# EAGLE design jill (EAGLE 7.3.0)
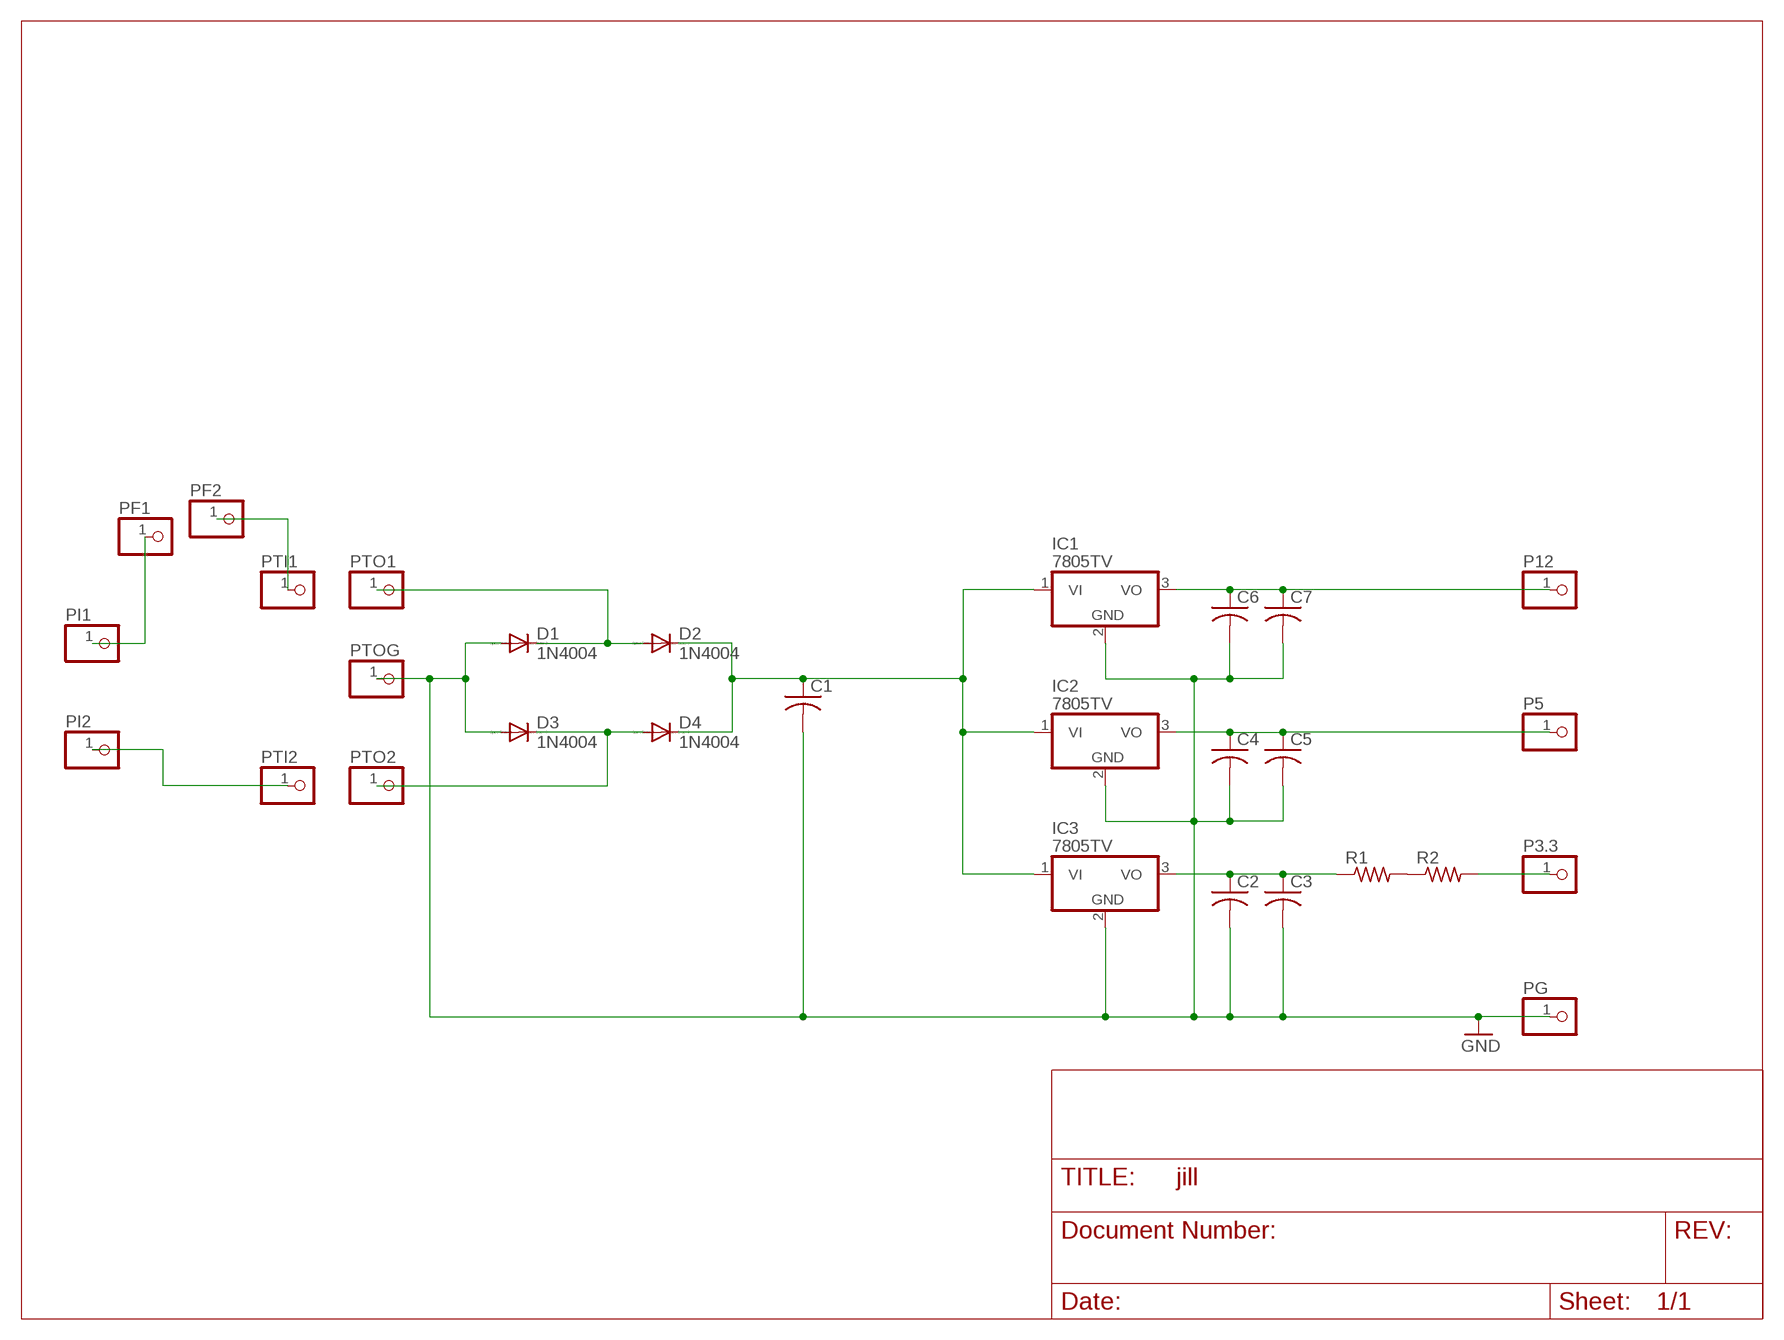
[diagram p0: schematic, sheet 1]

## Parts
C1  C-US050-075X075  [C050-075X075]
C2  C-US025-025X050  [C025-025X050]
C3  C-US025-025X050  [C025-025X050]
C4  C-US025-025X050  [C025-025X050]
C5  C-US025-025X050  [C025-025X050]
C6  C-US025-025X050  [C025-025X050]
C7  C-US025-025X050  [C025-025X050]
D1  1N4004  [DO41-10]
D2  1N4004  [DO41-10]
D3  1N4004  [DO41-10]
D4  1N4004  [DO41-10]
IC1  7805TV  [TO220V]
IC2  7805TV  [TO220V]
IC3  7805TV  [TO220V]
P3.3  PINHD-1X1  [1X01]
P5  PINHD-1X1  [1X01]
P12  PINHD-1X1  [1X01]
PF1  PINHD-1X1  [1X01]
PF2  PINHD-1X1  [1X01]
PG  PINHD-1X1  [1X01]
PI1  PINHD-1X1  [1X01]
PI2  PINHD-1X1  [1X01]
PTI1  PINHD-1X1  [1X01]
PTI2  PINHD-1X1  [1X01]
PTO1  PINHD-1X1  [1X01]
PTO2  PINHD-1X1  [1X01]
PTOG  PINHD-1X1  [1X01]
R1  R-US_0207/12  [0207/12]
R2  R-US_0207/12  [0207/12]

## Nets
GND: C1.2 C2.2 C3.2 C4.2 C5.2 C6.2 C7.2 D1.A D3.A IC1.2(GND) IC2.2(GND) IC3.2(GND) PG.1 PTOG.1
N$1: R1.2 R2.1
N$2: P3.3.1 R2.2
N$3: C2.1 C3.1 IC3.3(VO) R1.1
N$4: C4.1 C5.1 IC2.3(VO) P5.1
N$5: C6.1 C7.1 IC1.3(VO) P12.1
N$6: C1.1 D2.C D4.C IC1.1(VI) IC2.1(VI) IC3.1(VI)
N$7: D1.C D2.A PTO1.1
N$8: PF1.1 PI1.1
N$9: PF2.1 PTI1.1
N$10: PI2.1 PTI2.1
N$11: D3.C D4.A PTO2.1

## Library data of the parts
C1-C7 = rcl:C-US: CAPACITOR, American symbol
D1-D4 = diode:1N4004: DIODE general purpose rectifier, 1 A
IC1-IC3 = linear:78*: Positive VOLTAGE REGULATOR Source: http://cache.national.com/ds/LM/LM78L05.pdf http://www.fairchildsemi.com/ds/LM/LM7805.pdf
P3.3 P5 P12 PF1 PF2 PG PI1 PI2 PTI1 PTI2 PTO1 PTO2 PTOG = pinhead:PINHD-1X1: PIN HEADER
R1 R2 = rcl:R-US_: RESISTOR, American symbol

## Board
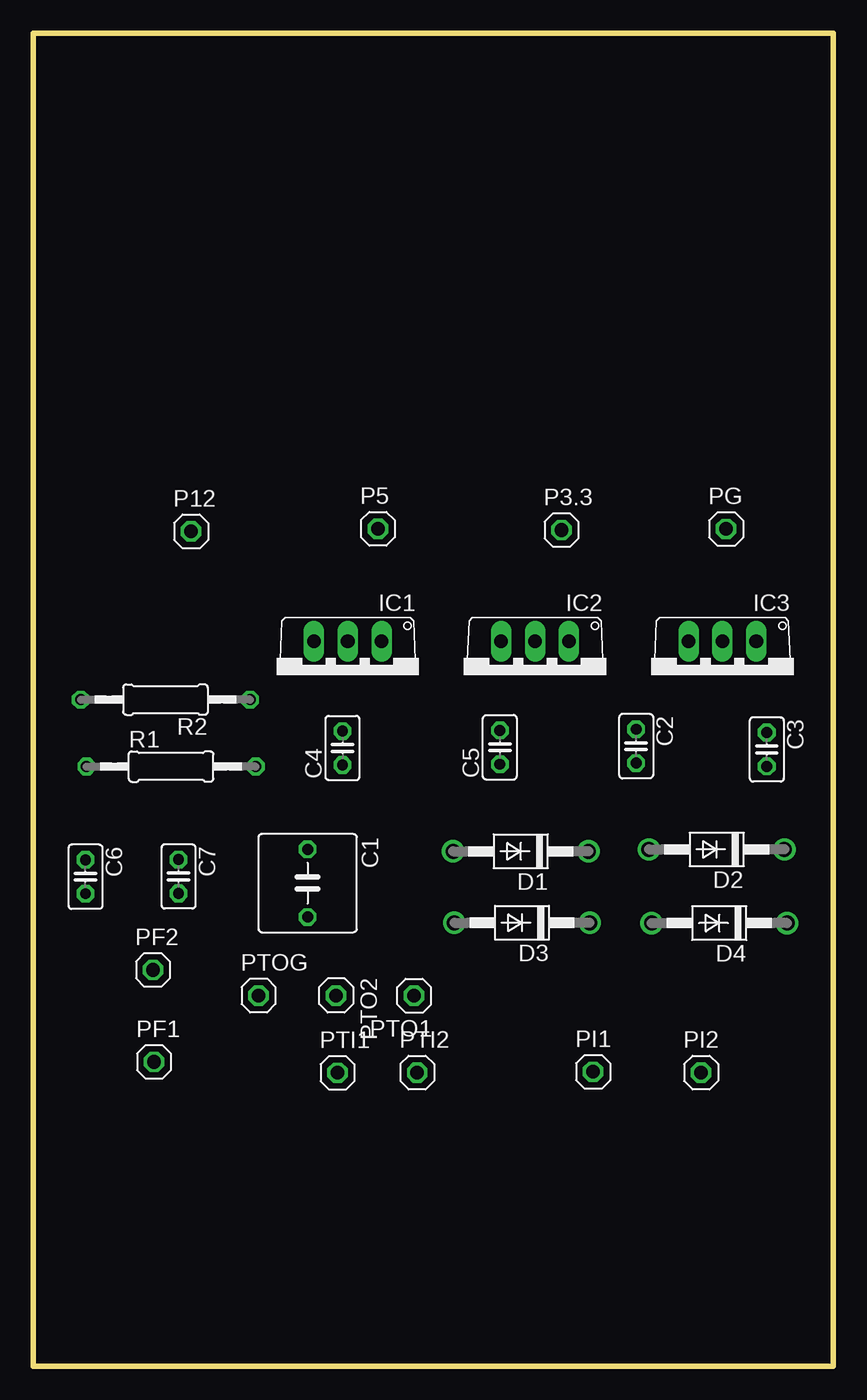
[diagram p1: board, top side]
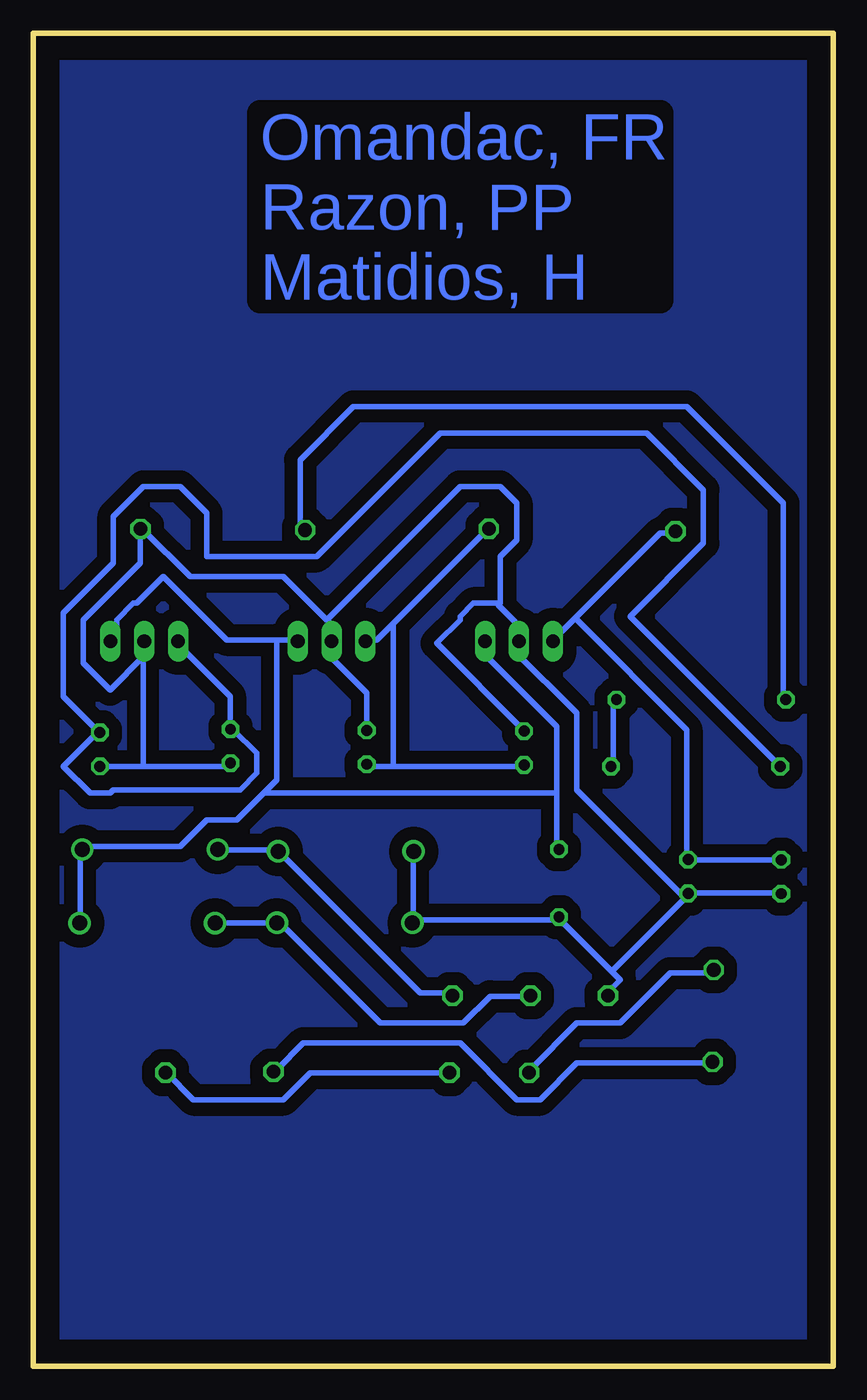
[diagram p2: board, bottom side, seen from below]

Size 60 x 100 mm. Coordinates in mm from the lower left corner, seen from the top.
Outline: 0,80 0,0
Outline: 0,0 60,0 60,100 0,100 0,0
Copper layers (1*16): Top 0.035mm / dielectric 8mm / Bottom 0.035mm
Design rules "default *": minimum track width 16mil, minimum drill 24mil, track to track 1mm, track to pad 1mm, pad to pad 16mil, via to via 16mil, smd to smd 16mil, copper to edge 70mil, drill to drill 12mil, minimum pad ring 10mil, minimum via ring 8mil, stop-mask expansion 4mil, vias tented up to drill 0mil, thermal gap 10mil

### Footprints (pad centres in the part's own frame; a part is rotated, then mirrored left to right if it is on the bottom)
C050-075X075 = drill 0.813 octagon: 1 -2.54,0; 2 2.54,0
C025-025X050 = drill 0.813 octagon: 1 -1.27,0; 2 1.27,0
DO41-10 = drill 1.118: A 5.08,0; C -5.08,0
TO220V = drill 1.016 long: 1 -2.54,-2.54; 2 0,-2.54; 3 2.54,-2.54
1X01 = drill 1.016 octagon: 1 0,0
0207/12 = drill 0.813 octagon: 1 -6.35,0; 2 6.35,0

### Placement (x,y rotation side)
C1  20.57,36.24 270 top
C2  45.21,46.52 270 top
C3  55.01,46.27 270 top
C4  23.19,46.38 90 top
C5  34.99,46.43 90 top
C6  3.91,36.72 270 top
C7  10.89,36.74 270 top
D1  36.56,38.63 180 top
D2  51.25,38.77 180 top
D3  36.65,33.27 180 top
D4  51.45,33.25 180 top
IC1  23.58,51.85 180 top
IC2  37.63,51.85 180 top
IC3  51.68,51.85 180 top
P3.3  39.61,62.73 0 top
P5  25.84,62.83 0 top
P12  11.83,62.63 0 top
PF1  9.05,22.83 0 top
PF2  8.97,29.73 0 top
PG  51.96,62.81 0 top
PI1  41.98,22.09 0 top
PI2  50.09,22.03 0 top
PTI1  22.81,22.01 0 top
PTI2  28.79,22.03 0 top
PTO1  28.56,27.79 180 top
PTO2  22.71,27.81 270 top
PTOG  16.89,27.81 0 top
R1  10.33,44.99 0 top
R2  9.91,50.01 180 top

### Tracks (layer width: path | path; a pad name or v marks a point on that pad's centre or on a via)
GND
  Bottom 0.406: 31.5,33.5 31.5,38.5 D1.A | C6.2 4,35.5 10.75,35.5 C7.2 | 16.62,29.62 16,29 17,28 PTOG.1 | 16.62,29.62 20.5,33.5 C1.2 20.75,33.5 31.5,33.5 | 16.62,29.62 11,35.25 C7.2 | 31.5,33.5 D3.A | 25.12,57.12 23.25,55.25 23.25,54.75 23.5,54.5 IC1.2 23.5,54.25 24,53.75 19.25,49 19.25,43.25 11.25,35.25 C7.2 | 25.12,57.12 25.25,57.25 27,57.25 28,56.25 28,56 29.75,54.25 23.25,47.75 C4.2 | C5.2 35,47.75 35,50.5 38,53.5 38,54 37.75,54.25 IC2.2 | 51.75,45 45.5,45 45.25,45.25 C2.2 | 51.75,45 C3.2 | 51.75,45 51.75,53.25 | 51.75,53.25 51.75,54.25 IC3.2 51.75,53.25 | 51.75,53.25 54.25,50.75 56.25,52.75 56.25,56 52,60.25 52,62.75 PG.1 51.75,62.75 48.25,59.25 41.25,59.25 38,56 | 37.75,55.75 37.75,54.5 IC2.2 | 38,56 37.75,55.75 | 25.12,57.12 25,57.25 25,60.75 23.75,62 23.75,64.75 25,66 28,66 38,56 | 37.75,55.75 IC2.2
GROUND
  pour Bottom: 0,0 60,0 60,100 0,100
N$1
  Bottom 0.406: R1.2 16.5,45 16.5,50 R2.1
N$2
  Bottom 0.406: R2.2 3.75,50.25 3.75,64.75 11,72 36,72 40,68 40,63.12 P3.3.1 39.5,62.5
N$3
  Bottom 0.406: IC3.3 49.25,54.25 45.25,50.25 45.25,48 C2.1 45,47.75 43.25,46 43.25,44.5 44.5,43.25 54,43.25 54.25,43 55.75,43 57.75,45 55.25,47.5 C3.1 55.25,47.75 57.75,50.25 57.75,56.5 54,60.25 54,63.75 51.75,66 49,66 47,64 47,60.75 38.75,60.75 29.5,70 14,70 9.75,65.75 9.75,61.75 15.25,56.25 4,45 R1.1
N$4
  Bottom 0.406: 33,45 34.75,45 C5.1 | 33,45 23.25,45 C4.1 | 33.12,55.62 26,62.75 P5.1 | 33.12,55.62 34.25,54.5 35,54.5 IC2.3 | 33,45 33,55.5 33.12,55.62
N$5
  Bottom 0.406: C6.1 4,38 10.75,38 C7.1 11,38.25 11,47.75 19.38,56.12 | 19.38,56.12 21,54.5 IC1.3 | 19.38,56.12 13,62.5 12,62.5 P12.1
N$6
  Bottom 0.406: 20.75,43 20.75,48 26.5,53.75 26,54.25 IC1.1 | 20.75,43 20.75,39 C1.1 | D4.C 56.5,33.25 56.5,38.75 D2.C 56.25,39 49,39 47,41 44.75,41 42.62,43.12 | 41.75,54.5 45.5,54.5 50.25,59.25 52.25,57.25 52.5,57.25 53.75,56 53.75,54.75 54,54.5 IC3.1 | 41.75,54.5 40.25,54.5 IC2.1 | 42.62,43.12 41.75,44 41.75,54.5 | 20.75,43 42.5,43 42.62,43.12
N$7
  Bottom 0.406: PTO1.1 28.75,28 31,28 41.5,38.5 D1.C 41.75,38.75 46,38.75 D2.A
N$8
  Bottom 0.406: PF1.1 9.25,22.75 19.25,22.75 22,20 23.75,20 28,24.25 39.75,24.25 41.75,22.25 PI1.1
N$9
  Bottom 0.406: PF2.1 9,29.5 12.25,29.5 16,25.75 19.25,25.75 22.75,22.25 PTI1.1
N$10
  Bottom 0.406: PTI2.1 29,22 39.25,22 41.25,20 48,20 50,22 PI2.1
N$11
  Bottom 0.406: PTO2.1 22.75,27.75 25.75,27.75 27.75,25.75 34,25.75 41.5,33.25 D3.C 41.75,33.25 D4.A

### Text on the board
Bottom: Omandac, FR / Razon, PP / Matidios, H